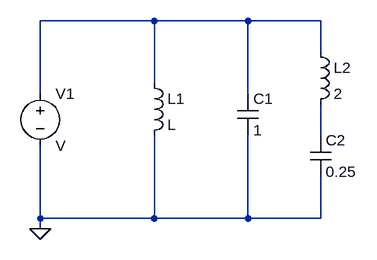
[diagram p0: schematic ejercicio1b.asc]
ejercicio1b.asc, the LTspice schematic file:
Version 4.1
SHEET 1 880 680
WIRE 192 -16 16 -16
WIRE 336 -16 192 -16
WIRE 448 -16 336 -16
WIRE 448 32 448 -16
WIRE 192 80 192 -16
WIRE 16 96 16 -16
WIRE 336 96 336 -16
WIRE 448 160 448 112
WIRE 16 288 16 176
WIRE 192 288 192 160
WIRE 192 288 16 288
WIRE 336 288 336 160
WIRE 336 288 192 288
WIRE 448 288 448 224
WIRE 448 288 336 288
WIRE 16 304 16 288
FLAG 16 304 0
SYMBOL voltage 16 80 R0
SYMATTR InstName V1
SYMBOL ind 176 64 R0
SYMATTR InstName L1
SYMBOL ind 432 16 R0
SYMATTR InstName L2
SYMATTR Value 2
SYMATTR SpiceLine Rser=1m
SYMBOL cap 320 96 R0
SYMATTR InstName C1
SYMATTR Value 1
SYMBOL cap 432 160 R0
SYMATTR InstName C2
SYMATTR Value 0.25

The netlist it stands for:
* ejercicio1b.asc
V1 N001 0 V
L1 N001 0 L
L2 N001 N002 2 Rser=1m
C1 N001 0 1
C2 N002 0 0.25
.backanno
.end